# Altium project DVT-PSU-LM5116-HT.PrjPcb
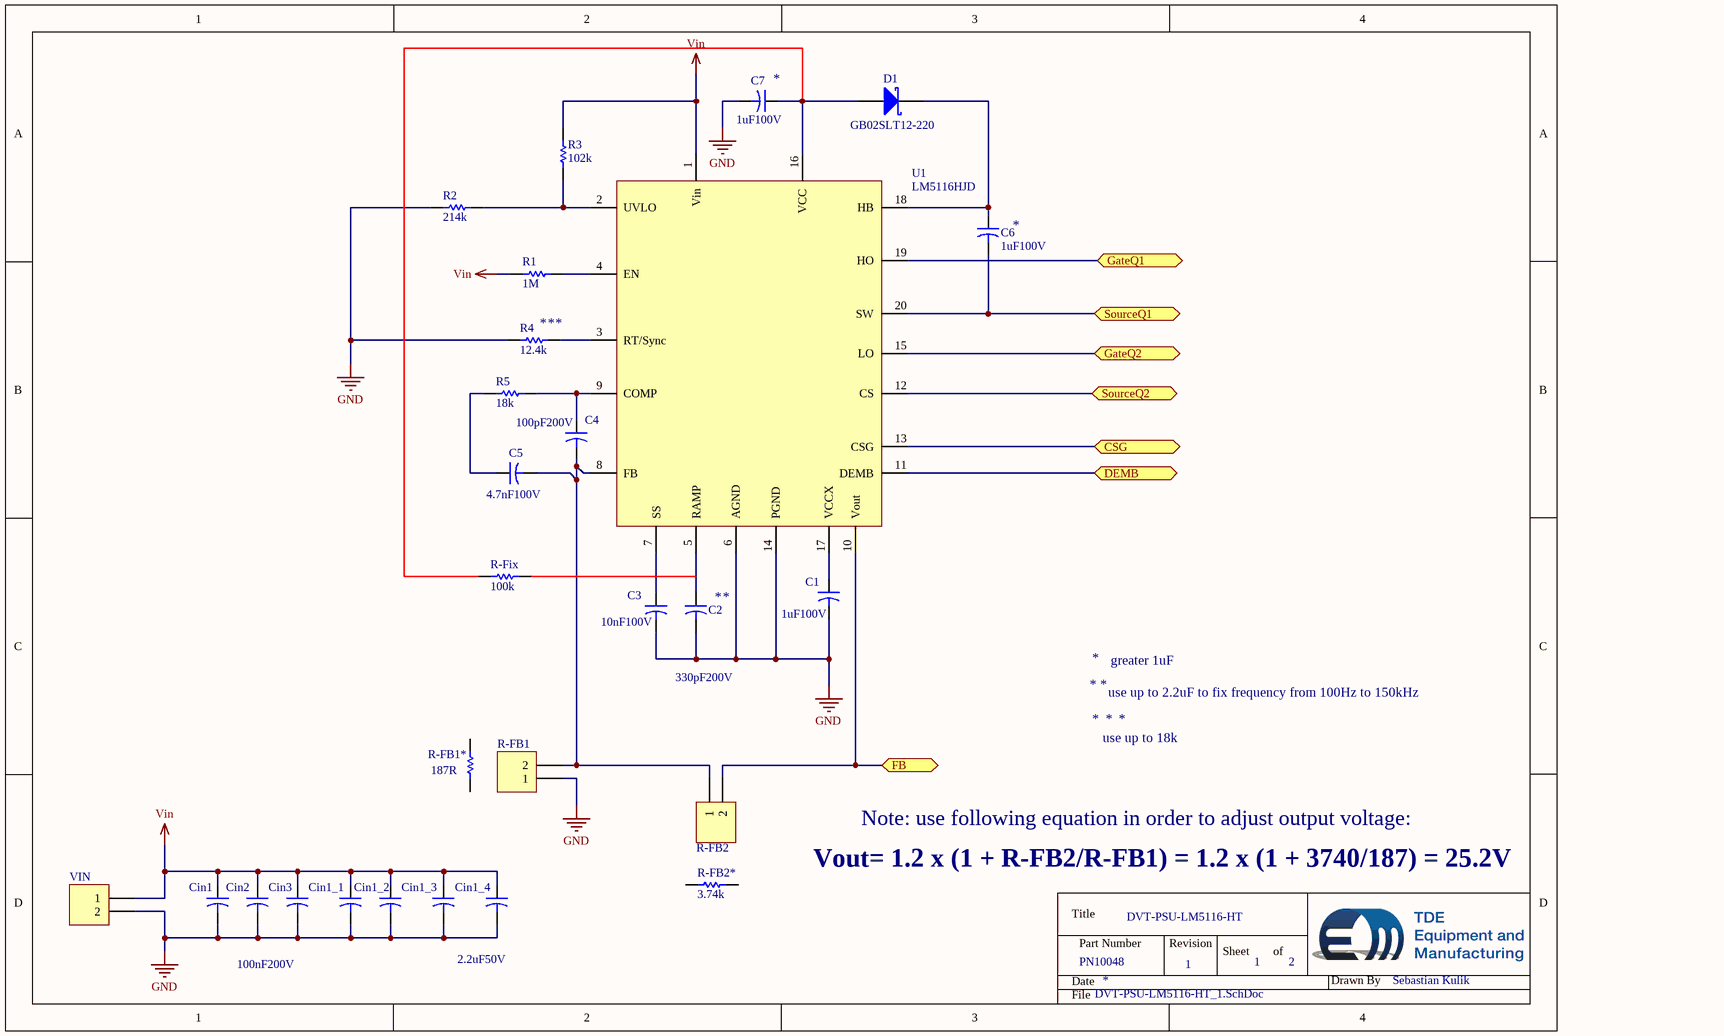
[diagram p0: DVT-PSU-LM5116-HT_1.SchDoc]
2 sheets, 44 parts. Net scope: flat (ports and power ports of the same name join across sheets).
Board file: DVT-PSU-LM5116-HT.PcbDoc
Sheets:
  DVT-PSU-LM5116-HT_1.SchDoc
  DVT-PSU-LM5116-HT_2.SchDoc

## Sheet DVT-PSU-LM5116-HT_1.SchDoc: DVT-PSU-LM5116-HT
size A4; Revision: 1; SheetNumber: 1; SheetTotal: 2; PartNumber: PN10048; Drawn By: Sebastian Kulik

### Parts
*  Eye  [Eye]  (value not drawn)
C1  value 1uF100V  [Dummy-10mm]  (hidden comment: Capacitor-Dummy-THT)
C2  value 330pF200V  [Dummy-10mm]  (hidden comment: Capacitor-Dummy-THT)
C3  value 10nF100V  [Dummy-10mm]  (hidden comment: Capacitor-Dummy-THT)
C4  value 100pF200V  [Dummy-10mm]  (hidden comment: Capacitor-Dummy-THT)
C5  value 4.7nF100V  [Dummy-10mm]  (hidden comment: Capacitor-Dummy-THT)
C6  value 1uF100V  [Dummy-10mm]  (hidden comment: Capacitor-Dummy-THT)
C7  value 1uF100V  [Dummy-10mm]  (hidden comment: Capacitor-Dummy-THT)
Cin1  Capacitor-Dummy-THT  [Dummy-10mm]  (value not drawn)
Cin1_1  Capacitor-Dummy-THT  [Dummy-10mm]  (value not drawn)
Cin1_2  Capacitor-Dummy-THT  [Dummy-10mm]  (value not drawn)
Cin1_3  Capacitor-Dummy-THT  [Dummy-10mm]  (value not drawn)
Cin1_4  value 2.2uF50V  [Dummy-10mm]  (hidden comment: Capacitor-Dummy-THT)
Cin2  Capacitor-Dummy-THT  [Dummy-10mm]  (value not drawn)
Cin3  value 100nF200V  [Dummy-10mm]  (hidden comment: Capacitor-Dummy-THT)
D1  GB02SLT12-220  [TO220AC]
R1  value 1M  [Dummy-10mm]  (hidden comment: Resistor-Dummy-THT)
R2  value 214k  [Dummy-10mm]  (hidden comment: Resistor-Dummy-THT)
R3  value 102k  [Dummy-10mm]  (hidden comment: Resistor-Dummy-THT)
R4  value 12.4k  [Dummy-10mm]  (hidden comment: Resistor-Dummy-THT)
R5  value 18k  [Dummy-10mm]  (hidden comment: Resistor-Dummy-THT)
R-FB1  PHOENIX_1715721  [Phoenix-2-5_08]  (value not drawn)
R-FB1*  value 187R  (hidden comment: Resistor-Dummy)
R-FB2  PHOENIX_1715721  [Phoenix-2-5_08]  (value not drawn)
R-FB2*  value 3.74k  (hidden comment: Resistor-Dummy)
R-Fix  value 100k  [Dummy-10mm]  (hidden comment: Resistor-Dummy-THT)  (graphical)
U1  LM5116HJD  [DIP-20-Ceramic-HT]
VIN  PHOENIX_1715721  [Phoenix-2-5_08]  (value not drawn)

### Ports
CSG, DEMB, FB, GateQ1, GateQ2, SourceQ1, SourceQ2

### Nets
GND: C1.2 C2.2 C3.2 C7.2 Cin1.2 Cin1_1.2 Cin1_2.2 Cin1_3.2 Cin1_4.2 Cin2.2 Cin3.2 R2.1 R4.1 R-FB1.1 U1.6(AGND) U1.13(CSG) U1.14(PGND) VIN.2 ; port CSG
Vin: Cin1.1 Cin1_1.1 Cin1_2.1 Cin1_3.1 Cin1_4.1 Cin2.1 Cin3.1 R1.1 R3.2 U1.1(Vin) VIN.1
NetC1_1: C1.1 U1.17(VCCX)
NetC2_1: C2.1 U1.5(RAMP)
NetC3_1: C3.1 U1.7(SS)
NetC4_1: C4.1 R5.2 U1.9(COMP)
NetC4_2: C4.2 C5.2 R-FB1.2 R-FB2.1 U1.8(FB)
NetC5_1: C5.1 R5.1
NetC6_1: C6.1 D1.1(K) U1.18(HB)
NetC6_2: C6.2 U1.20(SW) ; port SourceQ1
NetC7_1: C7.1 D1.2(A) U1.16(VCC)
NetCout1_1: R-FB2.2 U1.10(Vout) ; port FB
NetJ1_1: U1.11(DEMB) ; port DEMB
NetMeasuring_2: U1.12(CS) ; port SourceQ2
NetQ1_1: U1.19(HO) ; port GateQ1
NetQ2_1: U1.15(LO) ; port GateQ2
NetR1_2: R1.2 U1.4(EN)
NetR2_2: R2.2 R3.1 U1.2(UVLO)
NetR4_2: R4.2 U1.3(RT/Sync)

Not connected (* = marked no-connect by the designer): R-FB1* 1 2; R-FB2* 1 2; R-Fix 1 2

### Notes on the sheet
- (near C7) *
- (near C6) *
- (near R4) *
- (near C2) *
- *
- use up to 2.2uF to fix frequency from 100Hz to 150kHz
- greater 1uF
- use up to 18k
- Note: use following equation in order to adjust output voltage:
- Vout= 1.2 x (1 + R-FB2/R-FB1) = 1.2 x (1 + 3740/187) = 25.2V
- Title
- Date
- Part Number
- Revision
- Sheet
- of
- Drawn By
- File

### Library data of the parts
C1 C6 C7 = Capacitor-Dummy-THT: Deliverer PartNr: 1672256; Deliverer: Farnell; Published: 08.12.2015; Part Description: Capacitor-Dummy-THT; Publisher: Sebastian Kulik; PackageDescription: -; Manufacturer: -; Manufacturer PartNr: -; TDE-PN: -; Price: 5.25/1
C2 = Capacitor-Dummy-THT: Deliverer PartNr: 2452200; Deliverer: Farnell; Published: 08.12.2015; Part Description: Capacitor-Dummy-THT; Publisher: Sebastian Kulik; PackageDescription: -; Manufacturer: -; Manufacturer PartNr: -; TDE-PN: -; Price: 6.27/1
C3 = Capacitor-Dummy-THT: Deliverer PartNr: 2452194; Deliverer: Farnell; Published: 08.12.2015; Part Description: Capacitor-Dummy-THT; Publisher: Sebastian Kulik; PackageDescription: -; Manufacturer: -; Manufacturer PartNr: -; TDE-PN: -; Price: 9.84/1
C4 = Capacitor-Dummy-THT: Deliverer PartNr: 2452201; Deliverer: Farnell; Published: 08.12.2015; Part Description: Capacitor-Dummy-THT; Publisher: Sebastian Kulik; PackageDescription: -; Manufacturer: -; Manufacturer PartNr: -; TDE-PN: -; Price: 6.23/1
C5 = Capacitor-Dummy-THT: Deliverer PartNr: 2452197; Deliverer: Farnell; Published: 08.12.2015; Part Description: Capacitor-Dummy-THT; Publisher: Sebastian Kulik; PackageDescription: -; Manufacturer: -; Manufacturer PartNr: -; TDE-PN: -; Price: 6.98/1
Cin1 Cin2 = Capacitor-Dummy-THT: Deliverer PartNr: 2544877; Deliverer: Farnell; Value: 100nF200V; Published: 08.12.2015; Part Description: Capacitor-Dummy-THT; Publisher: Sebastian Kulik; PackageDescription: -; Manufacturer: -; Manufacturer PartNr: -; TDE-PN: -; Price: 0.51/10
Cin1_1-Cin1_3 = Capacitor-Dummy-THT: Deliverer PartNr: 2529490; Deliverer: Farnell; Value: 2.2uF50V; Published: 08.12.2015; Part Description: Capacitor-Dummy-THT; Publisher: Sebastian Kulik; PackageDescription: -; Manufacturer: -; Manufacturer PartNr: -; TDE-PN: -; Price: 1.28/1
Cin1_4 = Capacitor-Dummy-THT: Deliverer PartNr: 2529490; Deliverer: Farnell; Published: 08.12.2015; Part Description: Capacitor-Dummy-THT; Publisher: Sebastian Kulik; PackageDescription: -; Manufacturer: -; Manufacturer PartNr: -; TDE-PN: -; Price: 1.28/1
Cin3 = Capacitor-Dummy-THT: Deliverer PartNr: 2544877; Deliverer: Farnell; Published: 08.12.2015; Part Description: Capacitor-Dummy-THT; Publisher: Sebastian Kulik; PackageDescription: -; Manufacturer: -; Manufacturer PartNr: -; TDE-PN: -; Price: 0.51/10
D1 = GB02SLT12-220: Diode Shottky, 1200V, 2A; Deliverer PartNr: 1862679; Manufacturer: GeneSic; TDE-PN: DIS0051; Deliverer: Farnell; Published: 11.07.2016; Publisher: Sebastian Kulik; PackageDescription: TO220AC; Manufacturer PartNr: GB02SLT12-220; Price: 4.26/1
R1 = Resistor-Dummy-THT: Deliverer PartNr: 149-228; Deliverer: RS; Published: 08.12.2015; Publisher: Sebastian Kulik; PackageDescription: -; Manufacturer: -; Manufacturer PartNr: -; TDE-PN: -; Price: 0.046/10; Part Desicription: Resistor-Dummy-THT
R2 = Resistor-Dummy-THT: Deliverer PartNr: 754-8827; Deliverer: RS; Published: 08.12.2015; Publisher: Sebastian Kulik; PackageDescription: -; Manufacturer: -; Manufacturer PartNr: -; TDE-PN: -; Price: 0.41/5; Part Desicription: Resistor-Dummy-THT
R3 = Resistor-Dummy-THT: Deliverer PartNr: 701-8036; Deliverer: RS; Published: 08.12.2015; Publisher: Sebastian Kulik; PackageDescription: -; Manufacturer: -; Manufacturer PartNr: -; TDE-PN: -; Price: 0.602/5; Part Desicription: Resistor-Dummy-THT
R4 = Resistor-Dummy-THT: Deliverer PartNr: 755-0833; Deliverer: RS; Published: 08.12.2015; Publisher: Sebastian Kulik; PackageDescription: -; Manufacturer: -; Manufacturer PartNr: -; TDE-PN: -; Price: 0.202/5; Part Desicription: Resistor-Dummy-THT
R5 = Resistor-Dummy-THT: Deliverer PartNr: 148-792; Deliverer: RS; Published: 08.12.2015; Publisher: Sebastian Kulik; PackageDescription: -; Manufacturer: -; Manufacturer PartNr: -; TDE-PN: -; Part Desicription: Resistor-Dummy-THT; Price: 0.157/10
R-FB1 R-FB2 VIN = 2Pol_1715721: Phoenix, 2 pol, 5.08mm, 22A, 715721; Deliverer PartNr: 193-0564; Deliverer: RS; TDE-PN: CON0008; LatestRevisionDate: 02.05.2014; LatestRevisionNote: Re-released for DXP Platform.; Publisher: Sebastian Kulik; Manufacturer PartNr: 1715721; Manufacturer: Phoenix; PackageDescription: Phoenix-2-5_08; Price: 0.976/5
R-FB1* = Resistor-Dummy: Deliverer PartNr: 701-7159; Part Desicription: Resistor-Dummy-THT; Deliverer: RS; Published: 08.12.2015; Publisher: Sebastian Kulik; PackageDescription: -; Manufacturer: -; Manufacturer PartNr: -; TDE-PN: -; Price: 1.058/5
R-FB2* = Resistor-Dummy: Deliverer PartNr: 754-5709; Part Desicription: Resistor-Dummy-THT; Deliverer: RS; Published: 08.12.2015; Publisher: Sebastian Kulik; PackageDescription: -; Manufacturer: -; Manufacturer PartNr: -; TDE-PN: -; Price: 0.37/5
U1 = LM5116HJD: Step-Down controller, wide range input, HT; Deliverer PartNr: 595-LM5116HJD; Manufacturer: TI; Deliverer: Mouser; TDE-PN: IC0074; Published: 02.05.2016; PackageDescription: DIP-20-Ceramic-HT; Publisher: Sebastian Kulik; Manufacturer PartNr: LM5116HJD; Price: 156.14/1
R-Fix = Resistor-Dummy-THT: Published: 08.12.2015; Publisher: Sebastian Kulik; PackageDescription: -; Manufacturer: -; Manufacturer PartNr: -; TDE-PN: -; Deliverer PartNr: -; Deliverer: -; Part Desicription: Resistor-Dummy-THT; Price: *

## Sheet DVT-PSU-LM5116-HT_2.SchDoc: DVT-PSU-LM5116-HT
size A4; Revision: 1; SheetNumber: 2; SheetTotal: 2; PartNumber: PN10048; Drawn By: Sebastian Kulik
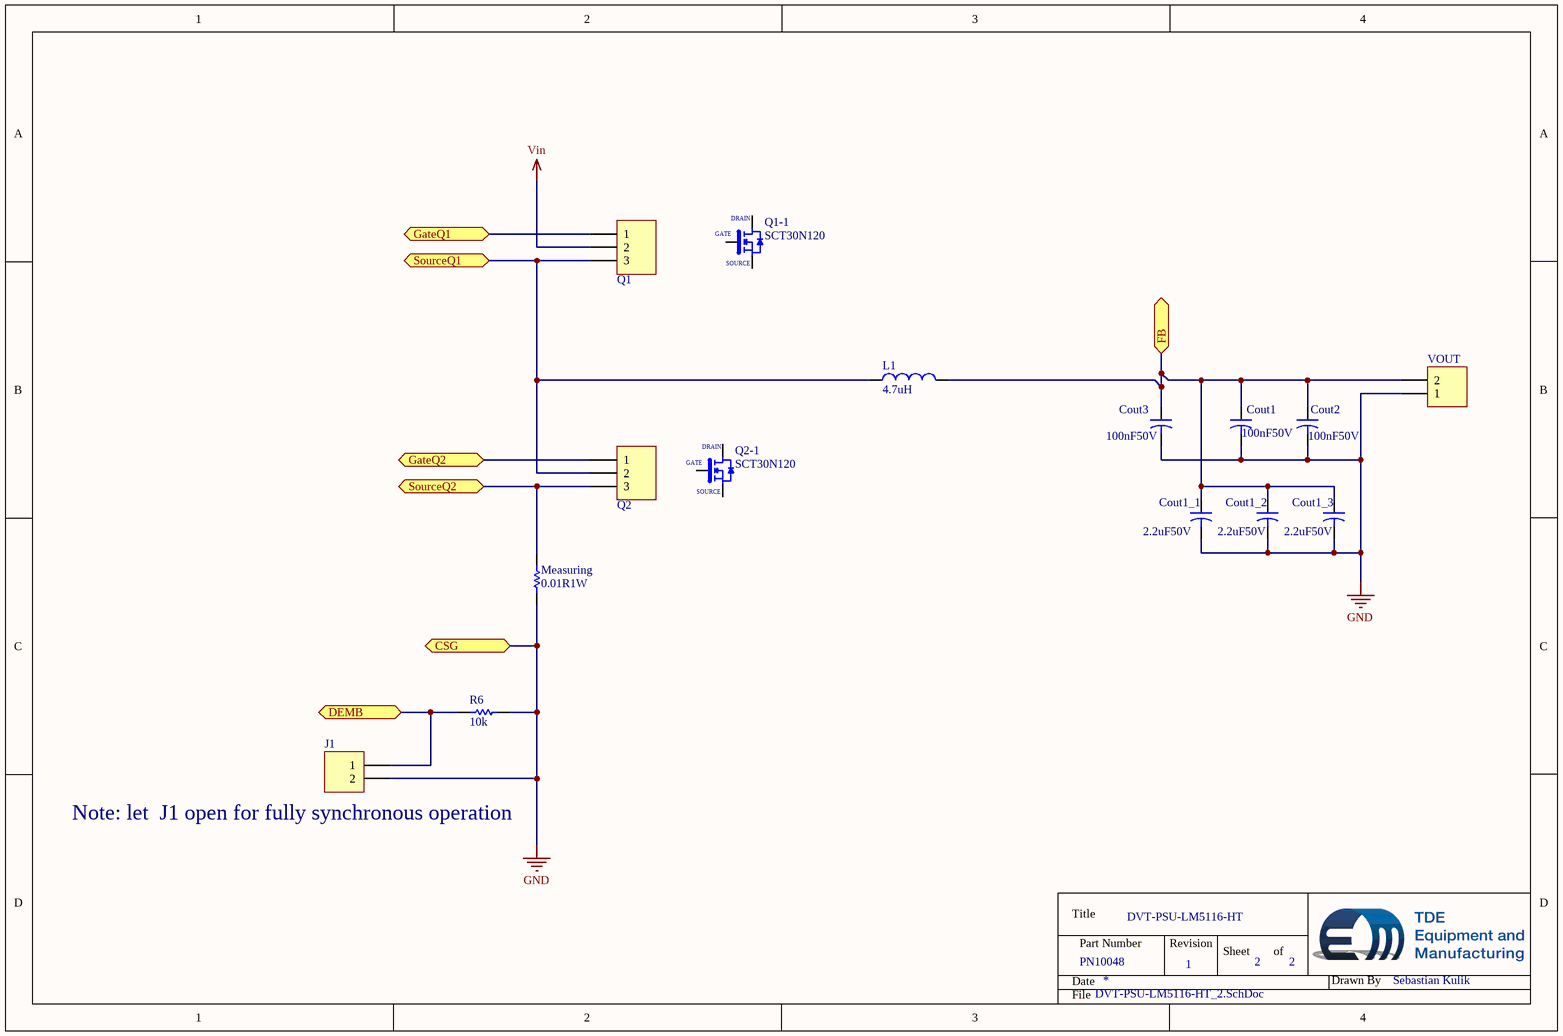
[diagram p1: DVT-PSU-LM5116-HT_2.SchDoc]

### Parts
**  Eye  [Eye]  (value not drawn)
Cout1  value 100nF50V  [Dummy-10mm]  (hidden comment: Capacitor-Dummy-THT)
Cout1_1  value 2.2uF50V  [Dummy-10mm]  (hidden comment: Capacitor-Dummy-THT)
Cout1_2  value 2.2uF50V  [Dummy-10mm]  (hidden comment: Capacitor-Dummy-THT)
Cout1_3  value 2.2uF50V  [Dummy-10mm]  (hidden comment: Capacitor-Dummy-THT)
Cout2  value 100nF50V  [Dummy-10mm]  (hidden comment: Capacitor-Dummy-THT)
Cout3  value 100nF50V  [Dummy-10mm]  (hidden comment: Capacitor-Dummy-THT)
J1  Plug_2_90_2.54  [HDR1X2]  (value not drawn)
L1  value 4.7uH  [WE-LHMI1335]  (hidden comment: 4u7H7.5A)
Measuring  value 0.01R1W  [Dummy-10mm]  (hidden comment: Resistor-Dummy-THT)
Q1  3Pol_TBL_5mm  [WE-TBL3-5]  (value not drawn)
Q1-1  SCT30N120  (graphical)
Q2  3Pol_TBL_5mm  [WE-TBL3-5]  (value not drawn)
Q2-1  SCT30N120  (graphical)
R6  value 10k  [Dummy-10mm]  (hidden comment: Resistor-Dummy-THT)
VOUT  PHOENIX_1715721  [Phoenix-2-5_08]  (value not drawn)

### Ports
CSG, DEMB, FB, GateQ1, GateQ2, SourceQ1, SourceQ2

### Nets
GND: Cout1.2 Cout1_1.2 Cout1_2.2 Cout1_3.2 Cout2.2 Cout3.2 J1.2 Measuring.1 R6.2 VOUT.1 ; port CSG
Vin: Q1.2
NetC6_2: L1.1 Q1.3 Q2.2 ; port SourceQ1
NetCout1_1: Cout1.1 Cout1_1.1 Cout1_2.1 Cout1_3.1 Cout2.1 Cout3.1 L1.2 VOUT.2 ; port FB
NetJ1_1: J1.1 R6.1 ; port DEMB
NetMeasuring_2: Measuring.2 Q2.3 ; port SourceQ2
NetQ1_1: Q1.1 ; port GateQ1
NetQ2_1: Q2.1 ; port GateQ2

Not connected (* = marked no-connect by the designer): Q1-1 1(Drain) 2(Source) 3(Gate); Q2-1 1(Drain) 2(Source) 3(Gate)

### Notes on the sheet
- (near J1) Note: let  J1 open for fully synchronous operation
- Title
- Date
- Part Number
- Revision
- Sheet
- of
- Drawn By
- File
- (in symbol SCT30N120-Symbol) DRAIN; GATE; SOURCE

### Library data of the parts
Cout1-Cout3 = Capacitor-Dummy-THT: Deliverer PartNr: 2452193; Deliverer: Farnell; Published: 08.12.2015; Part Description: Capacitor-Dummy-THT; Publisher: Sebastian Kulik; PackageDescription: -; Manufacturer: -; Manufacturer PartNr: -; TDE-PN: -; Price: 10.64/1
Cout1_1-Cout1_3 = Capacitor-Dummy-THT: as Cin1_4 on sheet DVT-PSU-LM5116-HT_1; Published: 08.12.2015; Part Description: Capacitor-Dummy-THT; Publisher: Sebastian Kulik; PackageDescription: -; Manufacturer: -; Manufacturer PartNr: -; TDE-PN: -; Price: 1.28/1
J1 = Plug_2_90_2.54: Plug, 2-Pin; Manufacturer PartNr: 61300211021; Manufacturer: WE; Deliverer PartNr: 2356176; Deliverer: Farnell; TDE-PN: CON0010; LatestRevisionDate: 14.05.2014; LatestRevisionNote: Re-released for DXP Platform.; Publisher: Sebastian Kulik
L1 = 4u7H7.5A: WE, LHMI; Deliverer PartNr: 74437377047; TDE-PN: P0041; Deliverer: WE; Manufacturer: WE; Manufacturer PartNr: 74437377047; Published: 11.07.2016; Publisher: Sebastian Kulik; PackageDescription: LHM1335; Price: 2.48/1
Measuring = Resistor-Dummy-THT: LVR01, 0.01 ohm, 1 W, ± 1%; Manufacturer: Vishay; Manufacturer PartNr: LVR01R0100FE70; Deliverer PartNr: 1108056; Deliverer: Farnell; Published: 08.12.2015; Publisher: Sebastian Kulik; PackageDescription: -; TDE-PN: -; Part Desicription: Resistor-Dummy-THT; Price: 2.61/1
Q1 Q2 = 3Pol_TBL_5mm: Plug,-3-Pin; Manufacturer: WE; Manufacturer PartNr: 691102710003; Deliverer PartNr: 826-7220; Deliverer: RS; TDE-PN: CON0044; Publisher: Sebastian Kulik; Price: 1.26/1
Q1-1 Q2-1 = SCT30N120-Symbol
R6 = Resistor-Dummy-THT: Deliverer PartNr: 148-736; Deliverer: RS; Published: 08.12.2015; Publisher: Sebastian Kulik; PackageDescription: -; Manufacturer: -; Manufacturer PartNr: -; TDE-PN: -; Part Desicription: Resistor-Dummy-THT; Price: 0.027/10
VOUT = 2Pol_1715721: as R-FB1 on sheet DVT-PSU-LM5116-HT_1; LatestRevisionDate: 02.05.2014; LatestRevisionNote: Re-released for DXP Platform.; Publisher: Sebastian Kulik; Manufacturer PartNr: 1715721; Manufacturer: Phoenix; PackageDescription: Phoenix-2-5_08; Price: 0.976/5

## Nets that join several sheets
GND: DVT-PSU-LM5116-HT_1 (18 pins), DVT-PSU-LM5116-HT_2 (10 pins)
Vin: DVT-PSU-LM5116-HT_1 (11 pins), DVT-PSU-LM5116-HT_2 (Q1.2)
NetC6_2: DVT-PSU-LM5116-HT_1 (C6.2 U1.20), DVT-PSU-LM5116-HT_2 (L1.1 Q1.3 Q2.2)
NetCout1_1: DVT-PSU-LM5116-HT_1 (R-FB2.2 U1.10), DVT-PSU-LM5116-HT_2 (8 pins)
NetJ1_1: DVT-PSU-LM5116-HT_1 (U1.11), DVT-PSU-LM5116-HT_2 (J1.1 R6.1)
NetMeasuring_2: DVT-PSU-LM5116-HT_1 (U1.12), DVT-PSU-LM5116-HT_2 (Measuring.2 Q2.3)
NetQ1_1: DVT-PSU-LM5116-HT_1 (U1.19), DVT-PSU-LM5116-HT_2 (Q1.1)
NetQ2_1: DVT-PSU-LM5116-HT_1 (U1.15), DVT-PSU-LM5116-HT_2 (Q2.1)